# Altium project IEEE_Very_Small_v2.PrjPcb
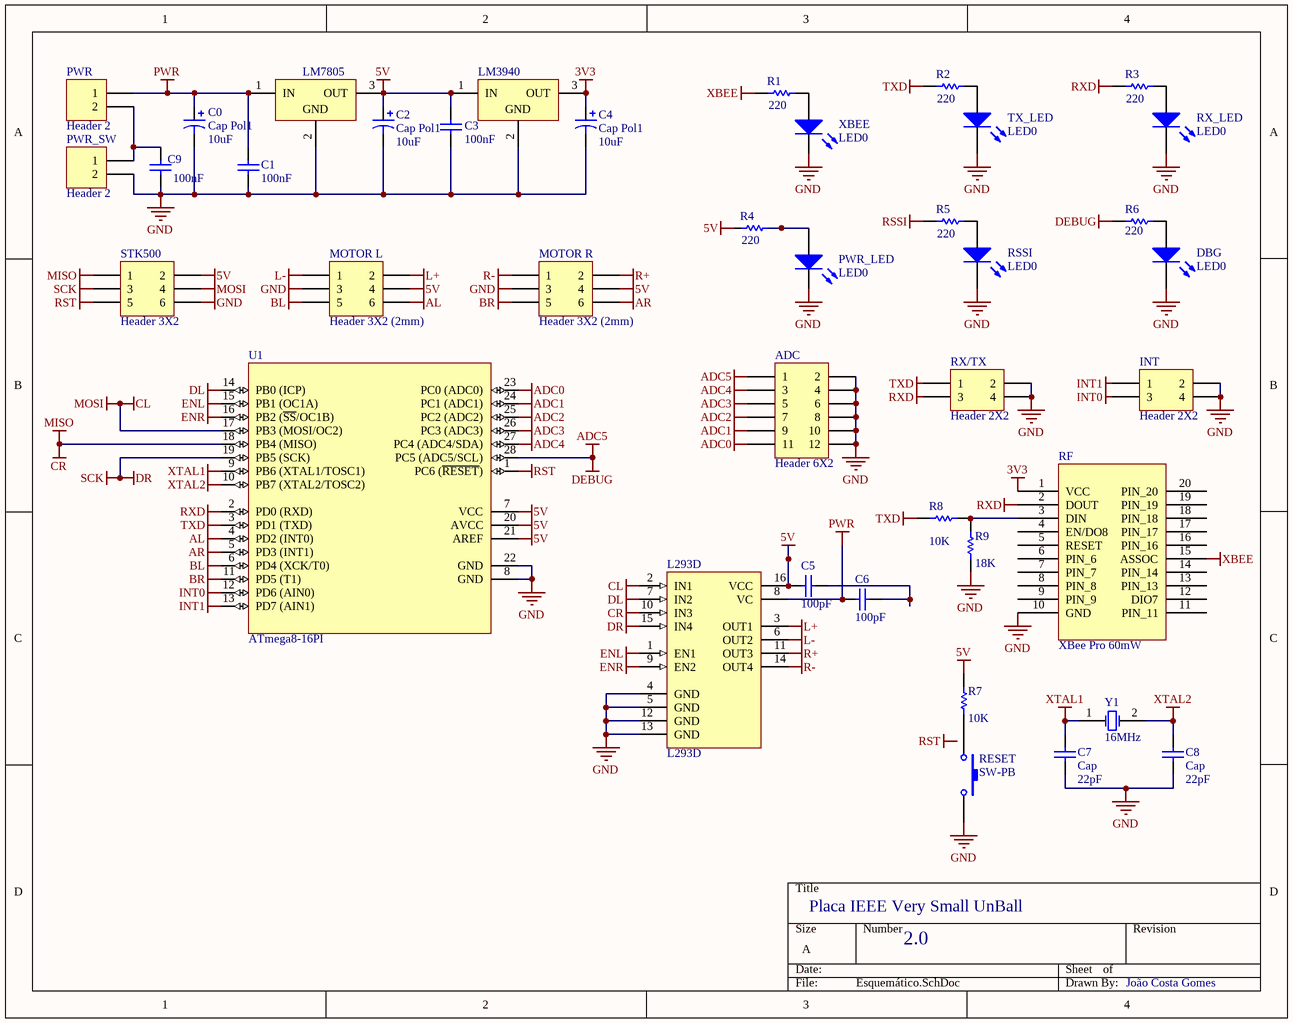
[diagram p0: Esquemático.SchDoc]
1 sheet, 40 parts. Net scope: global (net labels, ports and power ports of the same name join across sheets).
Board file: Board.PcbDoc

## Sheet Esquemático.SchDoc: Placa IEEE Very Small UnBall
size A; Author: George Andrew Brindeiro; CompanyName: UnBall; DrawnBy: George Andrew Brindeiro; Revision: A0; SheetNumber: 1; SheetTotal: 1

### Parts
ADC  Header 6X2  [HDR2X6]
C0  Cap Pol1  value 10uF  [B]
C1  value 100nF  [C_NANO_HOLES]  (hidden comment: Cap)
C2  Cap Pol1  value 10uF  [B]
C3  value 100nF  [C_NANO_HOLES]  (hidden comment: Cap)
C4  Cap Pol1  value 10uF  [B]
C5  value 100pF  [C_NANO_HOLES]  (hidden comment: Cap)
C6  value 100pF  [C_NANO_HOLES]  (hidden comment: Cap)
C7  Cap  value 22pF  [C_NANO_HOLES]
C8  Cap  value 22pF  [C_NANO_HOLES]
C9  value 100nF  [C_NANO_HOLES]  (hidden comment: Cap)
DBG  LED0  [B]
INT  Header 2X2  [HDR2X2]
L293D  L293D  [DIP16]
LM3940  LM3940IT-3.3  [T03B]  (value not drawn)
LM7805  µA7805CKC  [KC03]  (value not drawn)
MOTOR_L  Header 3X2 (2mm)  [HDR2X3]
MOTOR_R  Header 3X2 (2mm)  [HDR2X3]
PWR  Header 2  [HDR1X2]
PWR_LED  LED0  [B]
PWR_SW  Header 2  [HDR1X2]
R1  value 220  [AXIAL-0.3]
R2  value 220  [AXIAL-0.3]
R3  value 220  [AXIAL-0.3]
R4  value 220  [AXIAL-0.3]
R5  value 220  [AXIAL-0.3]
R6  value 220  [AXIAL-0.3]
R7  value 10K  [AXIAL-0.3]
R8  value 10K  [AXIAL-0.3]
R9  value 18K  [AXIAL-0.3]
RESET  SW-PB  [PUSHBUTTON]
RF  XBee Pro 60mW  [XBEE_PRO]
RSSI  LED0  [B]
RX/TX  Header 2X2  [HDR2X2]
RX_LED  LED0  [B]
STK500  Header 3X2  [HDR2X3]
TX_LED  LED0  [B]
U1  ATmega8-16PI  [28P3]
XBEE  LED0  [B]
Y1  16MHz  [HC-49U]

### Nets
3V3: C4.1 LM3940.3(OUT) RF.1(VCC)
5V: C2.1 C3.1 C5.1 L293D.16(VCC) LM3940.1(IN) LM7805.3(OUT) MOTOR_L.4 MOTOR_R.4 R7.2 STK500.2 U1.7(VCC) U1.20(AVCC) U1.21(AREF)
ADC0: ADC.11 U1.23(PC0_(ADC0))
ADC1: ADC.9 U1.24(PC1_(ADC1))
ADC2: ADC.7 U1.25(PC2_(ADC2))
ADC3: ADC.5 U1.26(PC3_(ADC3))
ADC4: ADC.3 U1.27(PC4_(ADC4/SDA))
ADC5: ADC.1 R6.1 U1.28(PC5_(ADC5/SCL))  [also labelled DEBUG]
AL: MOTOR_L.6 U1.4(PD2_(INT0))
AR: MOTOR_R.6 U1.5(PD3_(INT1))
BL: MOTOR_L.5 U1.6(PD4_(XCK/T0))
BR: MOTOR_R.5 U1.11(PD5_(T1))
CL: L293D.2(IN1) STK500.4 U1.17(PB3_(MOSI/OC2))  [also labelled MOSI]
CR: L293D.10(IN3) STK500.1 U1.18(PB4_(MISO))  [also labelled MISO]
DL: L293D.7(IN2) U1.14(PB0_(ICP))
DR: L293D.15(IN4) STK500.3 U1.19(PB5_(SCK))  [also labelled SCK]
ENL: L293D.1(EN1) U1.15(PB1_(OC1A))
ENR: L293D.9(EN2) U1.16(PB2_(~{SS}/OC1B))
GND: ADC.2 ADC.4 ADC.6 ADC.8 ADC.10 ADC.12 C0.2 C1.2 C2.2 C3.2 C4.2 C7.2 C8.2 C9.2 DBG.2(K) INT.2 INT.4 L293D.4(GND) L293D.5(GND) L293D.12(GND) L293D.13(GND) LM3940.2(GND) LM7805.2(GND) MOTOR_L.3 MOTOR_R.3 PWR_SW.2 R9.2 RESET.2 RF.10(GND) RSSI.2(K) RX/TX.2 RX/TX.4 RX_LED.2(K) STK500.6 TX_LED.2(K) U1.8(GND) U1.22(GND)
INT0: U1.12(PD6_(AIN0))
INT1: U1.13(PD7_(AIN1))
L+: L293D.3(OUT1) MOTOR_L.2
L-: L293D.6(OUT2) MOTOR_L.1
PWR: C0.1 C1.1 C6.1 L293D.8(VC) LM7805.1(IN) PWR.1
R+: L293D.11(OUT3) MOTOR_R.2
R-: L293D.14(OUT4) MOTOR_R.1
RSSI: R5.1
RST: STK500.5 U1.1(PC6_(~{RESET}))
RXD: R3.1 RF.2(DOUT) U1.2(PD0_(RXD))
TXD: R2.1 R8.2 U1.3(PD1_(TXD))
XBEE: R1.1 RF.15(ASSOC)
XTAL1: C7.1 U1.9(PB6_(XTAL1/TOSC1)) Y1.1(OSC1)
XTAL2: C8.1 U1.10(PB7_(XTAL2/TOSC2)) Y1.2(OSC2)
NetC5_2: C5.2 C6.2
NetC9_1: C9.1 PWR.2 PWR_SW.1
NetDBG_1: DBG.1(A) R6.2
NetPWR_LED_1: PWR_LED.1(A) R4.2
NetR1_2: R1.2 XBEE.1(A)
NetR2_2: R2.2 TX_LED.1(A)
NetR3_2: R3.2 RX_LED.1(A)
NetR5_2: R5.2 RSSI.1(A)
NetR7_1: R7.1 RESET.1
NetR8_1: R8.1 R9.1 RF.3(DIN)

Not connected (* = marked no-connect by the designer): INT 1 3; PWR_LED 2(K); R4 1; RF 4(EN/DO8) 5(RESET) 6(PIN_6) 7(PIN_7) 8(PIN_8) 9(PIN_9) 11(PIN_11) 12(DIO7) 13(PIN_13) 14(PIN_14) 16(PIN_16) 17(PIN_17) 18(PIN_18) 19(PIN_19) 20(PIN_20); RX/TX 1 3; XBEE 2(K)

### Notes on the sheet
- Placa IEEE Very Small UnBall
- 2.0
- João Costa Gomes
- Labels drawn without touching a wire or pin: 5V, GND, INT0, INT1, RST, RXD, TXD

### Library data of the parts
ADC = Header 6X2: Header, 6-Pin, Dual row; LatestRevisionDate: 17-Jul-2002; LatestRevisionNote: Re-released for DXP Platform.; Publisher: Altium Limited
C0 C2 C4 = Cap Pol1: Polarized Capacitor (Radial); Published: 8-Jun-2000; LatestRevisionDate: 17-Jul-2002; LatestRevisionNote: Re-released for DXP Platform.; PackageReference: RB7.6-15; Publisher: Altium Limited; PackageDescription: Polarized Capacitor (Radial); 2 Leads
C1 C3 C5-C9 = Cap: Capacitor; Published: 8-Jun-2000; LatestRevisionDate: 17-Jul-2002; LatestRevisionNote: Re-released for DXP Platform.; PackageReference: RAD-0.3; Publisher: Altium Limited
DBG PWR_LED RSSI RX_LED TX_LED XBEE = LED0: Typical INFRARED GaAs LED; Published: 8-Jun-2000; LatestRevisionDate: 08-Jul-2005; LatestRevisionNote: Mech Layer 1 removed.; PackageReference: LED-0; Publisher: Altium Limited; PackageDescription: LED; 2 Leads
INT RX/TX = Header 2X2: Header, 2-Pin, Dual row; LatestRevisionDate: 17-Jul-2002; LatestRevisionNote: Re-released for DXP Platform.; Publisher: Altium Limited
L293D = L293D: Push-Pull Four Channel Driver With Diode; Published: 8-Jun-2000; LatestRevisionDate: 06-Jun-2005; LatestRevisionNote: Stylized 3D Model Added.; DatasheetVersion: Jun-1996; PackageVersion: Apr-1996; PackageReference: DIP16; Publisher: Altium Limited; PackageDescription: DIP; 16 Leads; Row Spacing 7.62 mm; Pitch 2.54 mm; ComponentLink1Description: Manufacturer Link; ComponentLink1URL: http://www.st.com/; ComponentLink2Description: Datasheet; ComponentLink2URL: http://www.st.com/stonline/products/literature/ds/1330/l293d.pdf
LM3940 = LM3940IT-3.3: 1A Low Dropout Regulator for 5V to 3.3V Conversion; Manufacturer: National Semiconductor; CompType: LDO IC; PackageTopMarking: NSUZXYTTE#*LM3940IT*-3.3 P+; PowerWise: N; Published: 4-Dec-2008; DatasheetVersion: Jul-2007; PackageVersion: revL, Jan-1992; PackageReference: T03B; Publisher: Altium Limited; PackageDescription: TO-220, Molded, 3 Lead, Straight; PartNumber: LM3940IT-3.3; RoHS: O; PinCount: 3; DigiKeyPartNumber: LM3940IT-3.3-ND; ComponentLink1Description: LM3940 Datasheet; ComponentLink1URL: http://www.national.com/ds/LM/LM3940.pdf; ComponentLink2Description: LM3940 Web Page; ComponentLink2URL: http://www.national.com/pf/LM/LM3940.html; ComponentLink3Description: T03B Package Page; ComponentLink3URL: http://www.national.com/packaging/folders/t03b.html
LM7805 = µA7805CKC: Positive-Voltage Regulator; Note: Pin 2 is electrically connected to TAB.; Published: 15-Apr-2002; PackageReference: KC03; Publisher: Altium Limited; ComponentLink1Description: Manufacturer Link; ComponentLink1URL: http://www.ti.com/; ComponentLink2Description: Datasheet; ComponentLink2URL: http://www-s.ti.com/sc/ds/ua7805.pdf; DatasheetVersion: Jul-1999; PackageDescription: TO, Thru-Hole, Vertical, Heatsink Mounted; 3 In-Line Leads; Pitch 2.54 mm; PackageVersion: Sep-1995
MOTOR_L MOTOR_R STK500 = Header 3X2: Header, 3-Pin, Dual row; LatestRevisionDate: 17-Jul-2002; LatestRevisionNote: Re-released for DXP Platform.; Publisher: Altium Limited
PWR PWR_SW = Header 2: Header, 2-Pin; LatestRevisionDate: 17-Jul-2002; LatestRevisionNote: Re-released for DXP Platform.; Publisher: Altium Limited
R1-R9 = Res1: Resistor; Published: 8-Jun-2000; LatestRevisionDate: 17-Jul-2002; LatestRevisionNote: Re-released for DXP Platform.; PackageReference: AXIAL-0.3; Publisher: Altium Limited; PackageDescription: Axial Device, Thru-Hole; 2 Leads; 0.3 in Pin Spacing
RESET = SW-PB: Switch; Published: 24-Mar-1999; LatestRevisionDate: 17-Jul-2002; LatestRevisionNote: Re-released for DXP Platform.; PackageReference: SPST-2; Publisher: Altium Limited
RF = XBee
U1 = ATmega8-16PI: 8-Bit AVR Microcontroller with 8K Bytes of In-System Programmable Flash Memory; Published: 17-Sep-2003; DatasheetVersion: 2486H-AVR-09/02; PackageVersion: revB, Sep-2001; PackageReference: 28P3; Publisher: Altium Limited; PackageDescription: 28-lead (0.300"/7.62mm Wide) Plastic Dual Inline Package (PDIP); Supplier 1: Digi-Key; Supplier Part Number 1: ATMEGA8-16PI-ND; Supplier 2: Mouser; Supplier Part Number 2: 556-ATMEGA8-16PI; ComponentLink1Description: Datasheet; ComponentLink1URL: http://www.atmel.com/dyn/resources/prod_documents/doc2486.pdf; ComponentLink2Description: Atmel.com Home; ComponentLink2URL: http://www.atmel.com
Y1 = ECS-120-32-1: Crystal Oscillator; Published: 17-Jul-2002; DatasheetDocument: 18-Apr-2000; PackageReference: HC-49U; Publisher: Altium Limited; ComponentLink1Description: Manufacturer Link; ComponentLink1URL: http://www.ecsxtal.com/; ComponentLink2Description: Datasheet; ComponentLink2URL: http://www.ecsxtal.com/pdf2/HC49U.PDF